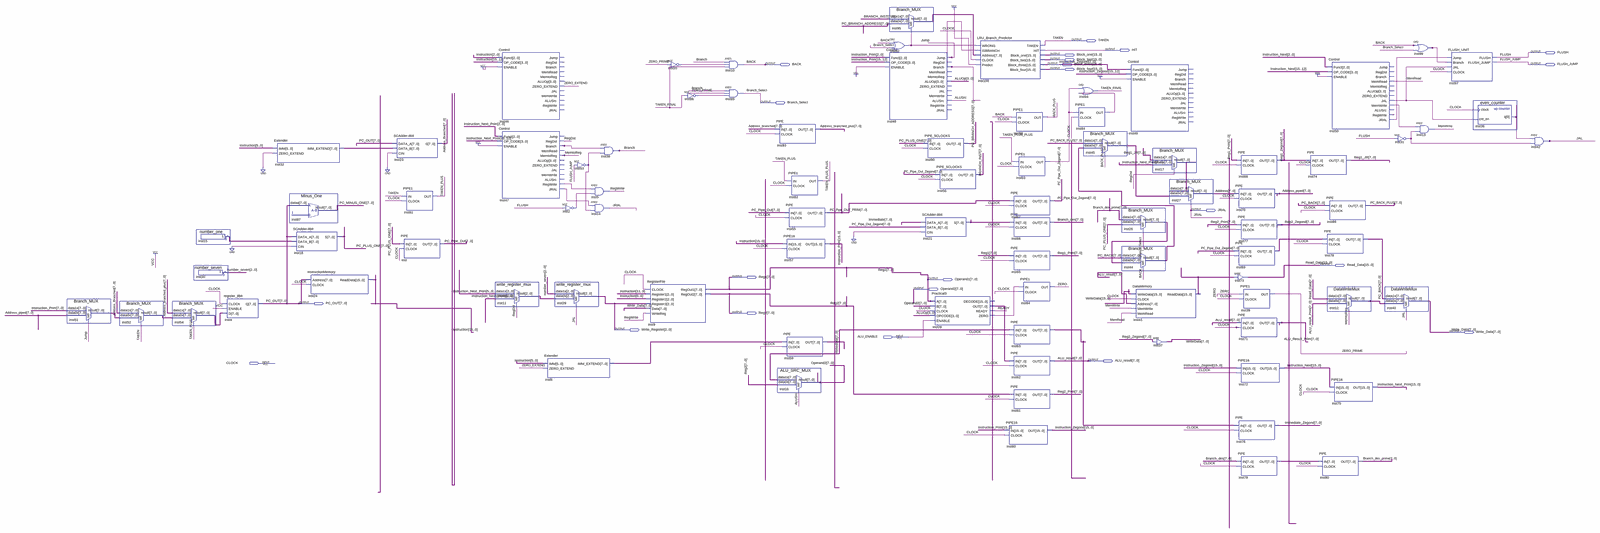
[diagram p0: schematic sheet, whole]
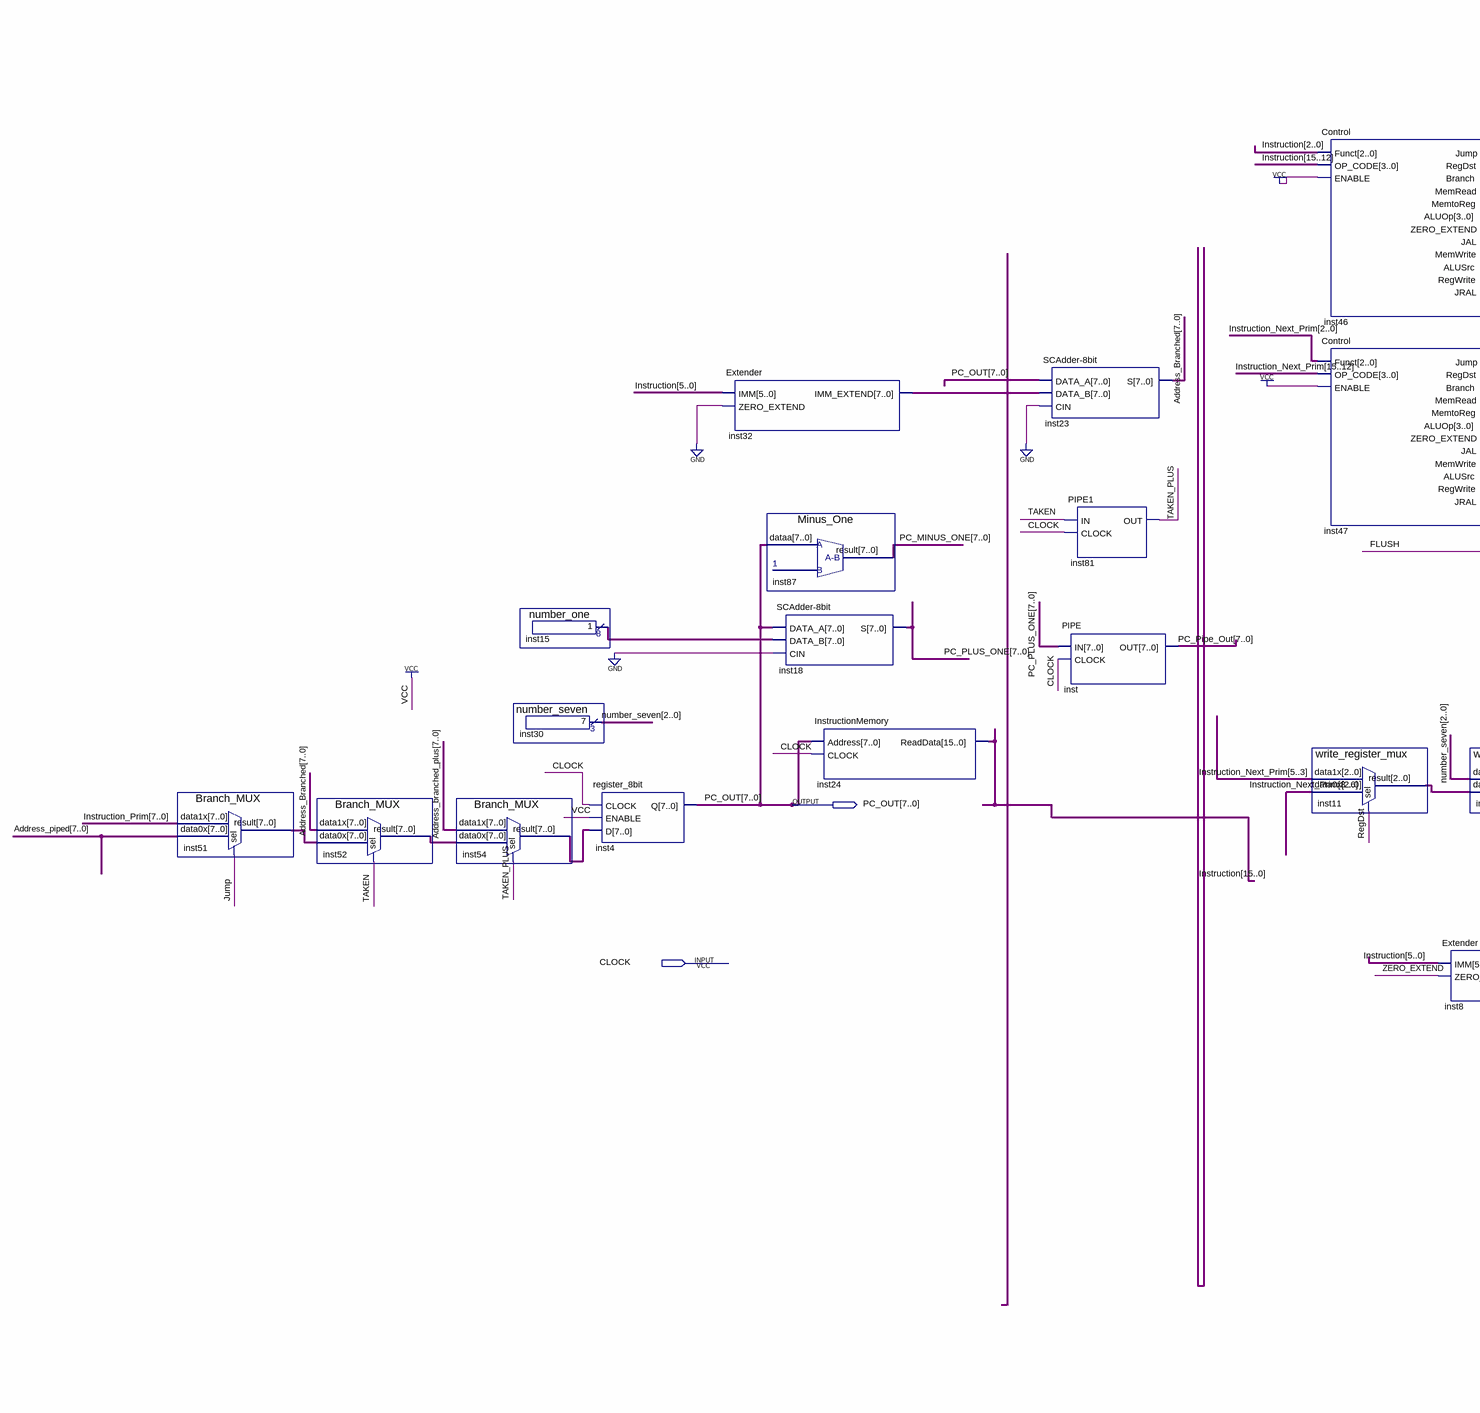
[diagram p1: schematic sheet, left part]
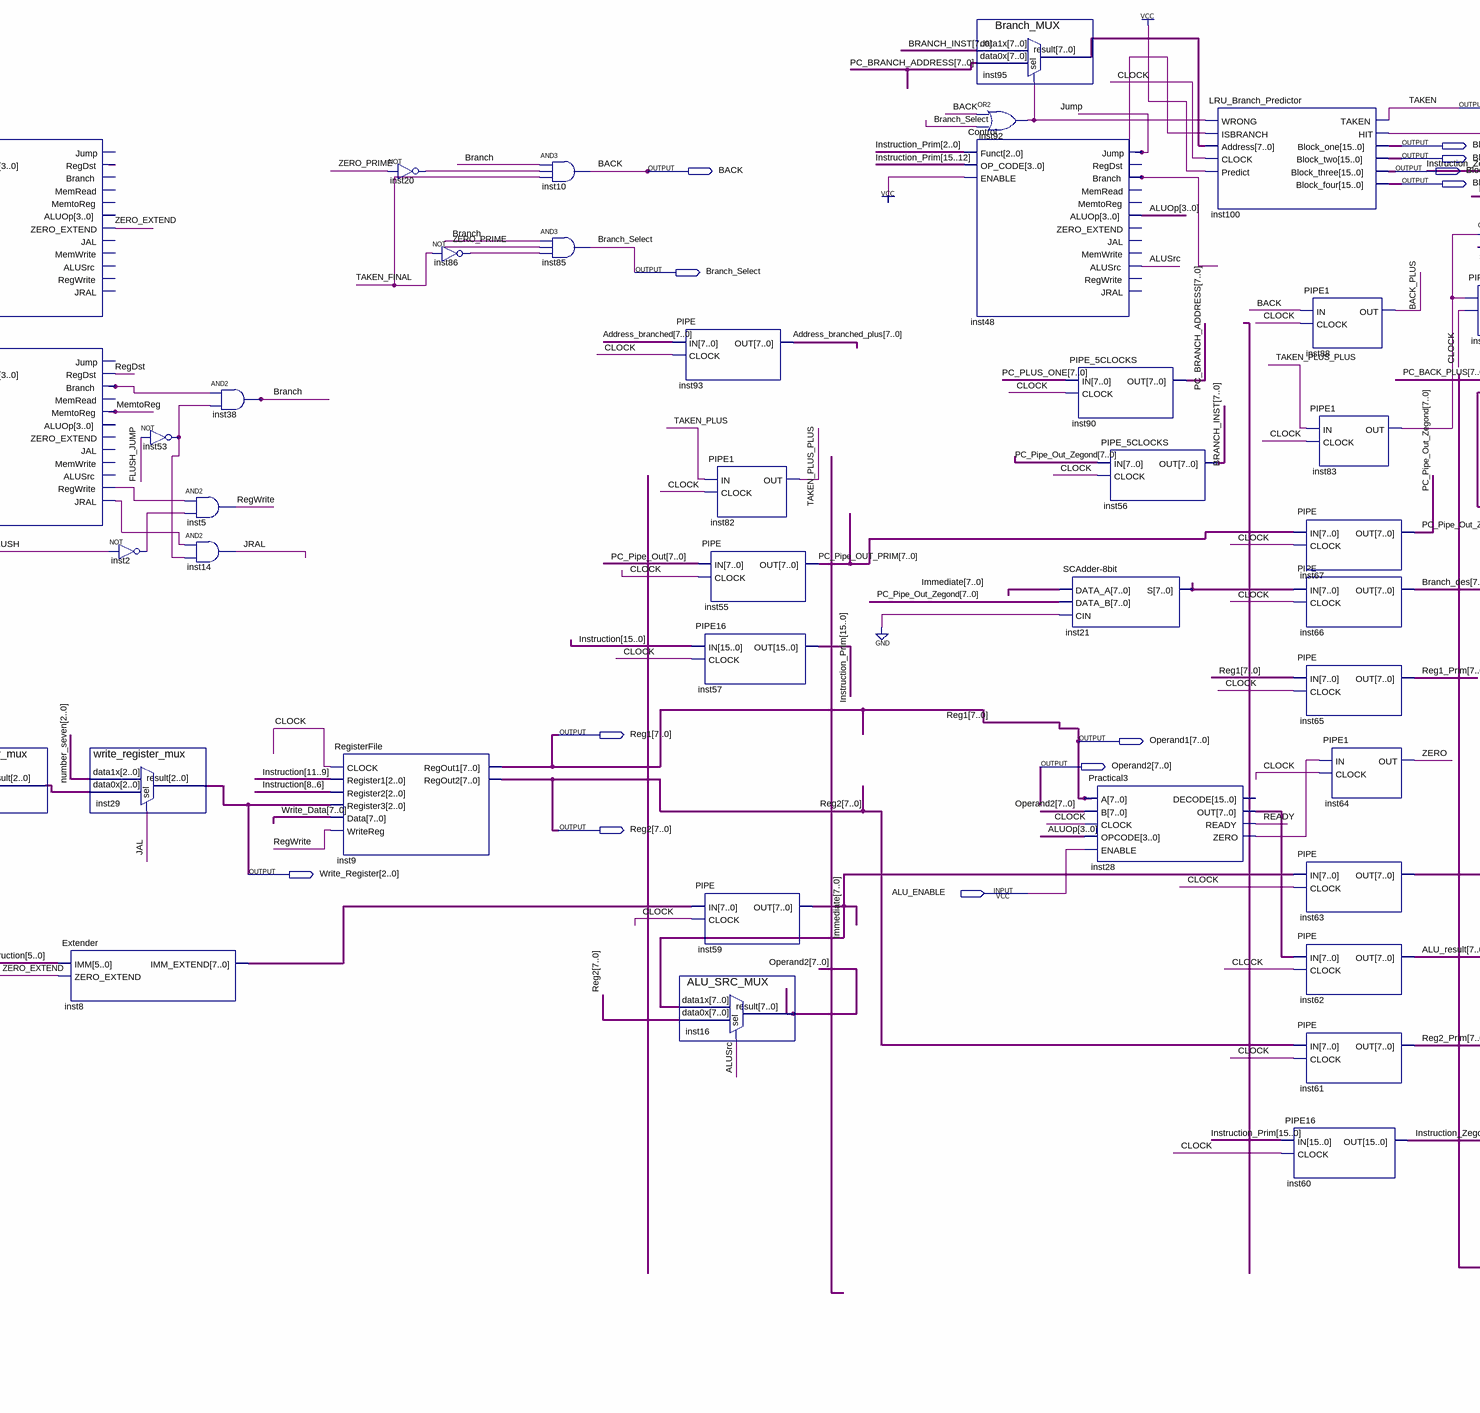
[diagram p2: schematic sheet, centre part]
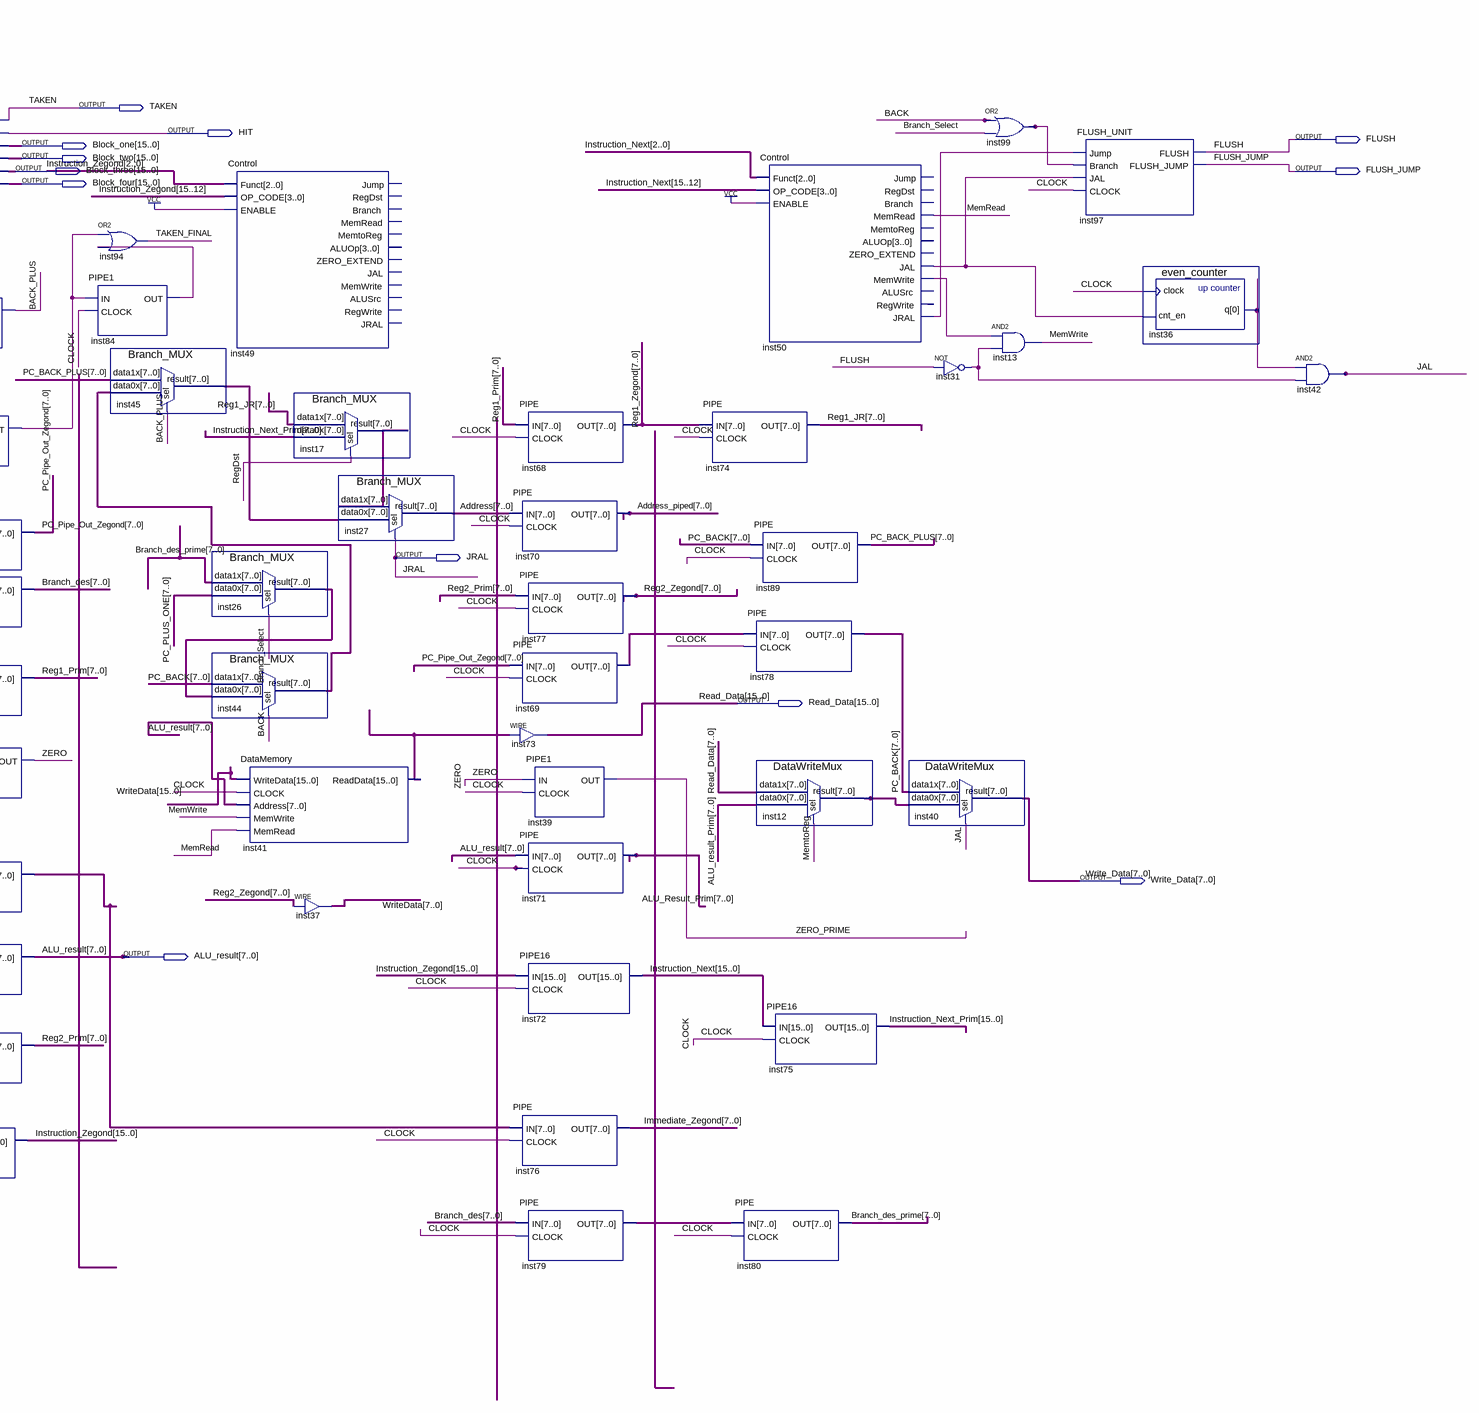
[diagram p3: schematic sheet, right part]
// Quartus schematic MIPS_CPU.bdf as structural Verilog: 86 symbols, 22 pins
module MIPS_CPU (
  input  ALU_ENABLE,
  input  CLOCK,
  output TAKEN,
  output HIT,
  output FLUSH,
  output [15:0] Block_one,
  output [15:0] Block_two,
  output BACK,
  output [15:0] Block_three,
  output FLUSH_JUMP,
  output [15:0] Block_four,
  output Branch_Select,
  output JRAL,
  output [15:0] Read_Data,
  output [7:0] Reg1,
  output [7:0] Operand1,
  output [7:0] Operand2,
  output [7:0] PC_OUT,
  output [7:0] Reg2,
  output [2:0] Write_Register,
  output [7:0] Write_Data,
  output [7:0] ALU_result
);

  wire ALUSrc, BACK_PLUS, Branch, inst2_out, inst20_out, inst28_zero, inst31_out, inst36_q, inst46_regdst,
       inst47_branch, inst47_jral, inst47_regwrite, inst48_branch, inst50_jal, inst50_jral, inst50_memwrite,
       inst50_regwrite, inst53_out, inst83_out, inst84_out, inst86_out, inst92_out, inst99_out, JAL, Jump,
       MemRead, MemtoReg, MemWrite, READY, RegDst, RegWrite, TAKEN_FINAL, TAKEN_PLUS, TAKEN_PLUS_PLUS, ZERO,
       ZERO_EXTEND, ZERO_PRIME;
  wire [2:0] inst11_result, number_seven;
  wire [3:0] ALUOp;
  wire [7:0] Address, Address_Branched, Address_branched_plus, Address_piped, ALU_result_Prim, Branch_des,
       Branch_des_prime, BRANCH_INST, Immediate, Immediate_Zegond, inst8_imm_extend, inst12_result,
       inst15_result, inst17_result, inst21_s, inst26_result, inst28_out, inst32_imm_extend, inst44_result,
       inst45_result, inst51_result, inst52_result, inst54_result, inst63_out, inst69_out, inst79_out,
       inst95_result, PC_BACK, PC_BACK_PLUS, PC_BRANCH_ADDRESS, PC_MINUS_ONE, PC_Pipe_Out, PC_Pipe_OUT_PRIM,
       PC_Pipe_Out_Zegond, PC_PLUS_ONE, Reg1_JR, Reg1_Prim, Reg1_Zegond, Reg2_Prim, Reg2_Zegond;
  wire [15:0] inst41_readdata, Instruction, Instruction_Next, Instruction_Next_Prim, Instruction_Prim,
       Instruction_Zegond, WriteData;

  Branch_MUX inst51 (.data1x(Instruction_Prim[7:0]), .data0x(Address_piped), .sel(Jump), .result(inst51_result));
  Branch_MUX inst52 (.data1x(Address_Branched), .data0x(inst51_result), .sel(TAKEN), .result(inst52_result));
  Branch_MUX inst54 (.data1x(Address_branched_plus), .data0x(inst52_result), .sel(TAKEN_PLUS), .result(inst54_result));
  number_seven inst30 (.result(number_seven));
  number_one inst15 (.result(inst15_result));
  register_8bit inst4 (.CLOCK(CLOCK), .ENABLE(1'b1), .D(inst54_result), .Q(PC_OUT));
  Extender inst32 (.IMM(Instruction[5:0]), .ZERO_EXTEND(1'b0), .IMM_EXTEND(inst32_imm_extend));
  Minus_One inst87 (.dataa(PC_OUT), .result(PC_MINUS_ONE));
  \SCAdder-8bit  inst18 (.DATA_A(PC_OUT), .DATA_B(inst15_result), .CIN(1'b0), .S(PC_PLUS_ONE));
  InstructionMemory inst24 (.Address(PC_OUT), .CLOCK(CLOCK), .ReadData(Instruction));
  \SCAdder-8bit  inst23 (.DATA_A(PC_OUT), .DATA_B(inst32_imm_extend), .CIN(1'b0), .S(Address_Branched));
  PIPE1 inst81 (.IN(TAKEN), .CLOCK(CLOCK), .OUT(TAKEN_PLUS));
  PIPE inst (.IN(PC_PLUS_ONE), .CLOCK(CLOCK), .OUT(PC_Pipe_Out));
  Control inst46 (
    .Funct(Instruction[2:0]), .OP_CODE(Instruction[15:12]), .ENABLE(1'b1), .RegDst(inst46_regdst),
    .ZERO_EXTEND(ZERO_EXTEND));  // open: Jump, Branch, MemRead, MemtoReg, ALUOp, JAL, MemWrite, ALUSrc, RegWrite, JRAL
  Control inst47 (
    .Funct(Instruction_Next_Prim[2:0]), .OP_CODE(Instruction_Next_Prim[15:12]), .ENABLE(1'b1),
    .RegDst(RegDst), .Branch(inst47_branch), .MemtoReg(MemtoReg), .RegWrite(inst47_regwrite),
    .JRAL(inst47_jral));  // open: Jump, MemRead, ALUOp, ZERO_EXTEND, JAL, MemWrite, ALUSrc
  write_register_mux inst11 (
    .data1x(Instruction_Next_Prim[5:3]), .data0x(Instruction_Next_Prim[8:6]), .sel(RegDst),
    .result(inst11_result));
  write_register_mux inst29 (.data1x(number_seven), .data0x(inst11_result), .sel(JAL), .result(Write_Register));
  Extender inst8 (.IMM(Instruction[5:0]), .ZERO_EXTEND(ZERO_EXTEND), .IMM_EXTEND(inst8_imm_extend));
  not inst53 (inst53_out, FLUSH_JUMP);
  not inst2 (inst2_out, FLUSH);
  and inst5 (RegWrite, inst47_regwrite, inst2_out);
  and inst14 (JRAL, inst47_jral, inst53_out);
  and inst38 (Branch, inst47_branch, inst53_out);
  RegisterFile inst9 (
    .CLOCK(CLOCK), .Register1(Instruction[11:9]), .Register2(Instruction[8:6]), .Register3(Write_Register),
    .Data(Write_Data), .WriteReg(RegWrite), .RegOut1(Operand1), .RegOut2(Reg2));
  not inst20 (inst20_out, ZERO_PRIME);
  not inst86 (inst86_out, TAKEN_FINAL);
  and inst10 (BACK, Branch, inst20_out, TAKEN_FINAL);
  and inst85 (Branch_Select, Branch, ZERO_PRIME, inst86_out);
  PIPE inst93 (.IN(Address_Branched), .CLOCK(CLOCK), .OUT(Address_branched_plus));
  PIPE1 inst82 (.IN(TAKEN_PLUS), .CLOCK(CLOCK), .OUT(TAKEN_PLUS_PLUS));
  PIPE inst55 (.IN(PC_Pipe_Out), .CLOCK(CLOCK), .OUT(PC_Pipe_OUT_PRIM));
  PIPE16 inst57 (.IN(Instruction), .CLOCK(CLOCK), .OUT(Instruction_Prim));
  PIPE inst59 (.IN(inst8_imm_extend), .CLOCK(CLOCK), .OUT(Immediate));
  ALU_SRC_MUX inst16 (.data1x(Immediate), .data0x(Reg2), .sel(ALUSrc), .result(Operand2));
  Branch_MUX inst95 (.data1x(BRANCH_INST), .data0x(PC_BRANCH_ADDRESS), .sel(inst92_out), .result(inst95_result));
  or inst92 (inst92_out, BACK, Branch_Select);
  Control inst48 (
    .Funct(Instruction_Prim[2:0]), .OP_CODE(Instruction_Prim[15:12]), .ENABLE(1'b1), .Jump(Jump),
    .Branch(inst48_branch), .ALUOp(ALUOp), .ALUSrc(ALUSrc));  // open: RegDst, MemRead, MemtoReg, ZERO_EXTEND, JAL, MemWrite, RegWrite, JRAL
  \SCAdder-8bit  inst21 (.DATA_A(Immediate), .DATA_B(PC_Pipe_Out_Zegond), .CIN(1'b0), .S(inst21_s));
  PIPE_5CLOCKS inst90 (.IN(PC_PLUS_ONE), .CLOCK(CLOCK), .OUT(PC_BRANCH_ADDRESS));
  PIPE_5CLOCKS inst56 (.IN(PC_Pipe_Out_Zegond), .CLOCK(CLOCK), .OUT(BRANCH_INST));
  Practical3 inst28 (
    .A(Operand1), .B(Operand2), .CLOCK(CLOCK), .OPCODE(ALUOp), .ENABLE(ALU_ENABLE), .OUT(inst28_out),
    .READY(READY), .ZERO(inst28_zero));  // open: DECODE
  LRU_Branch_Predictor inst100 (
    .WRONG(inst92_out), .ISBRANCH(inst48_branch), .Address(inst95_result), .CLOCK(CLOCK), .Predict(1'b1),
    .TAKEN(TAKEN), .HIT(HIT), .Block_one(Block_one), .Block_two(Block_two), .Block_three(Block_three),
    .Block_four(Block_four));
  PIPE1 inst88 (.IN(BACK), .CLOCK(CLOCK), .OUT(BACK_PLUS));
  PIPE1 inst83 (.IN(TAKEN_PLUS_PLUS), .CLOCK(CLOCK), .OUT(inst83_out));
  PIPE inst67 (.IN(PC_Pipe_OUT_PRIM), .CLOCK(CLOCK), .OUT(PC_Pipe_Out_Zegond));
  PIPE inst66 (.IN(inst21_s), .CLOCK(CLOCK), .OUT(Branch_des));
  PIPE inst65 (.IN(Operand1), .CLOCK(CLOCK), .OUT(Reg1_Prim));
  PIPE inst63 (.IN(Immediate), .CLOCK(CLOCK), .OUT(inst63_out));
  PIPE inst62 (.IN(inst28_out), .CLOCK(CLOCK), .OUT(ALU_result));
  PIPE inst61 (.IN(Reg2), .CLOCK(CLOCK), .OUT(Reg2_Prim));
  PIPE16 inst60 (.IN(Instruction_Prim), .CLOCK(CLOCK), .OUT(Instruction_Zegond));
  PIPE1 inst64 (.IN(inst28_zero), .CLOCK(CLOCK), .OUT(ZERO));
  PIPE1 inst84 (.IN(inst83_out), .CLOCK(CLOCK), .OUT(inst84_out));
  or inst94 (TAKEN_FINAL, inst83_out, inst84_out);
  Branch_MUX inst45 (.data1x(PC_BACK_PLUS), .data0x(inst44_result), .sel(BACK_PLUS), .result(inst45_result));
  Control inst49 (
    .Funct(Instruction_Zegond[2:0]), .OP_CODE(Instruction_Zegond[15:12]), .ENABLE(1'b1));  // open: Jump, RegDst, Branch, MemRead, MemtoReg, ALUOp, ZERO_EXTEND, JAL, MemWrite, ALUSrc, RegWrite, JRAL
  Branch_MUX inst26 (.data1x(Branch_des_prime), .data0x(PC_PLUS_ONE), .sel(Branch_Select), .result(inst26_result));
  Branch_MUX inst44 (.data1x(PC_BACK), .data0x(inst26_result), .sel(BACK), .result(inst44_result));
  DataMemory inst41 (
    .WriteData(WriteData), .CLOCK(CLOCK), .Address(ALU_result), .MemWrite(MemWrite), .MemRead(MemRead),
    .ReadData(inst41_readdata));
  Branch_MUX inst17 (.data1x(Reg1_JR), .data0x(Instruction_Next_Prim[7:0]), .sel(RegDst), .result(inst17_result));
  Branch_MUX inst27 (.data1x(inst17_result), .data0x(inst45_result), .sel(JRAL), .result(Address));
  assign WriteData[7:0] = Reg2_Zegond;  // WIRE inst37
  PIPE inst68 (.IN(Reg1_Prim), .CLOCK(CLOCK), .OUT(Reg1_Zegond));
  PIPE inst70 (.IN(Address), .CLOCK(CLOCK), .OUT(Address_piped));
  PIPE inst77 (.IN(Reg2_Prim), .CLOCK(CLOCK), .OUT(Reg2_Zegond));
  PIPE inst69 (.IN(PC_Pipe_Out_Zegond), .CLOCK(CLOCK), .OUT(inst69_out));
  assign Read_Data = inst41_readdata;  // WIRE inst73
  PIPE1 inst39 (.IN(ZERO), .CLOCK(CLOCK), .OUT(ZERO_PRIME));
  PIPE inst71 (.IN(ALU_result), .CLOCK(CLOCK), .OUT(ALU_result_Prim));
  PIPE16 inst72 (.IN(Instruction_Zegond), .CLOCK(CLOCK), .OUT(Instruction_Next));
  PIPE inst76 (.IN(inst63_out), .CLOCK(CLOCK), .OUT(Immediate_Zegond));
  PIPE inst79 (.IN(Branch_des), .CLOCK(CLOCK), .OUT(inst79_out));
  PIPE inst74 (.IN(Reg1_Zegond), .CLOCK(CLOCK), .OUT(Reg1_JR));
  PIPE inst78 (.IN(inst69_out), .CLOCK(CLOCK), .OUT(PC_BACK));
  PIPE inst80 (.IN(inst79_out), .CLOCK(CLOCK), .OUT(Branch_des_prime));
  Control inst50 (
    .Funct(Instruction_Next[2:0]), .OP_CODE(Instruction_Next[15:12]), .ENABLE(1'b1), .MemRead(MemRead),
    .JAL(inst50_jal), .MemWrite(inst50_memwrite), .RegWrite(inst50_regwrite), .JRAL(inst50_jral));  // open: Jump, RegDst, Branch, MemtoReg, ALUOp, ZERO_EXTEND, ALUSrc
  PIPE inst89 (.IN(PC_BACK), .CLOCK(CLOCK), .OUT(PC_BACK_PLUS));
  DataWriteMux inst12 (.data1x(Read_Data[7:0]), .data0x(ALU_result_Prim), .sel(MemtoReg), .result(inst12_result));
  PIPE16 inst75 (.IN(Instruction_Next), .CLOCK(CLOCK), .OUT(Instruction_Next_Prim));
  not inst31 (inst31_out, FLUSH);
  DataWriteMux inst40 (.data1x(PC_BACK), .data0x(inst12_result), .sel(JAL), .result(Write_Data));
  or inst99 (inst99_out, BACK, Branch_Select);
  and inst13 (MemWrite, inst50_memwrite, inst31_out);
  FLUSH_UNIT inst97 (
    .Jump(inst50_jral), .Branch(inst99_out), .JAL(inst50_jal), .CLOCK(CLOCK), .FLUSH(FLUSH),
    .FLUSH_JUMP(FLUSH_JUMP));
  even_counter inst36 (.clock(CLOCK), .cnt_en(inst50_jal), .q(inst36_q));
  and inst42 (JAL, inst36_q, inst31_out);

  assign Reg1 = Operand1;
endmodule
